# EAGLE design DNVT_box_front_2 (EAGLE 9.6.2)
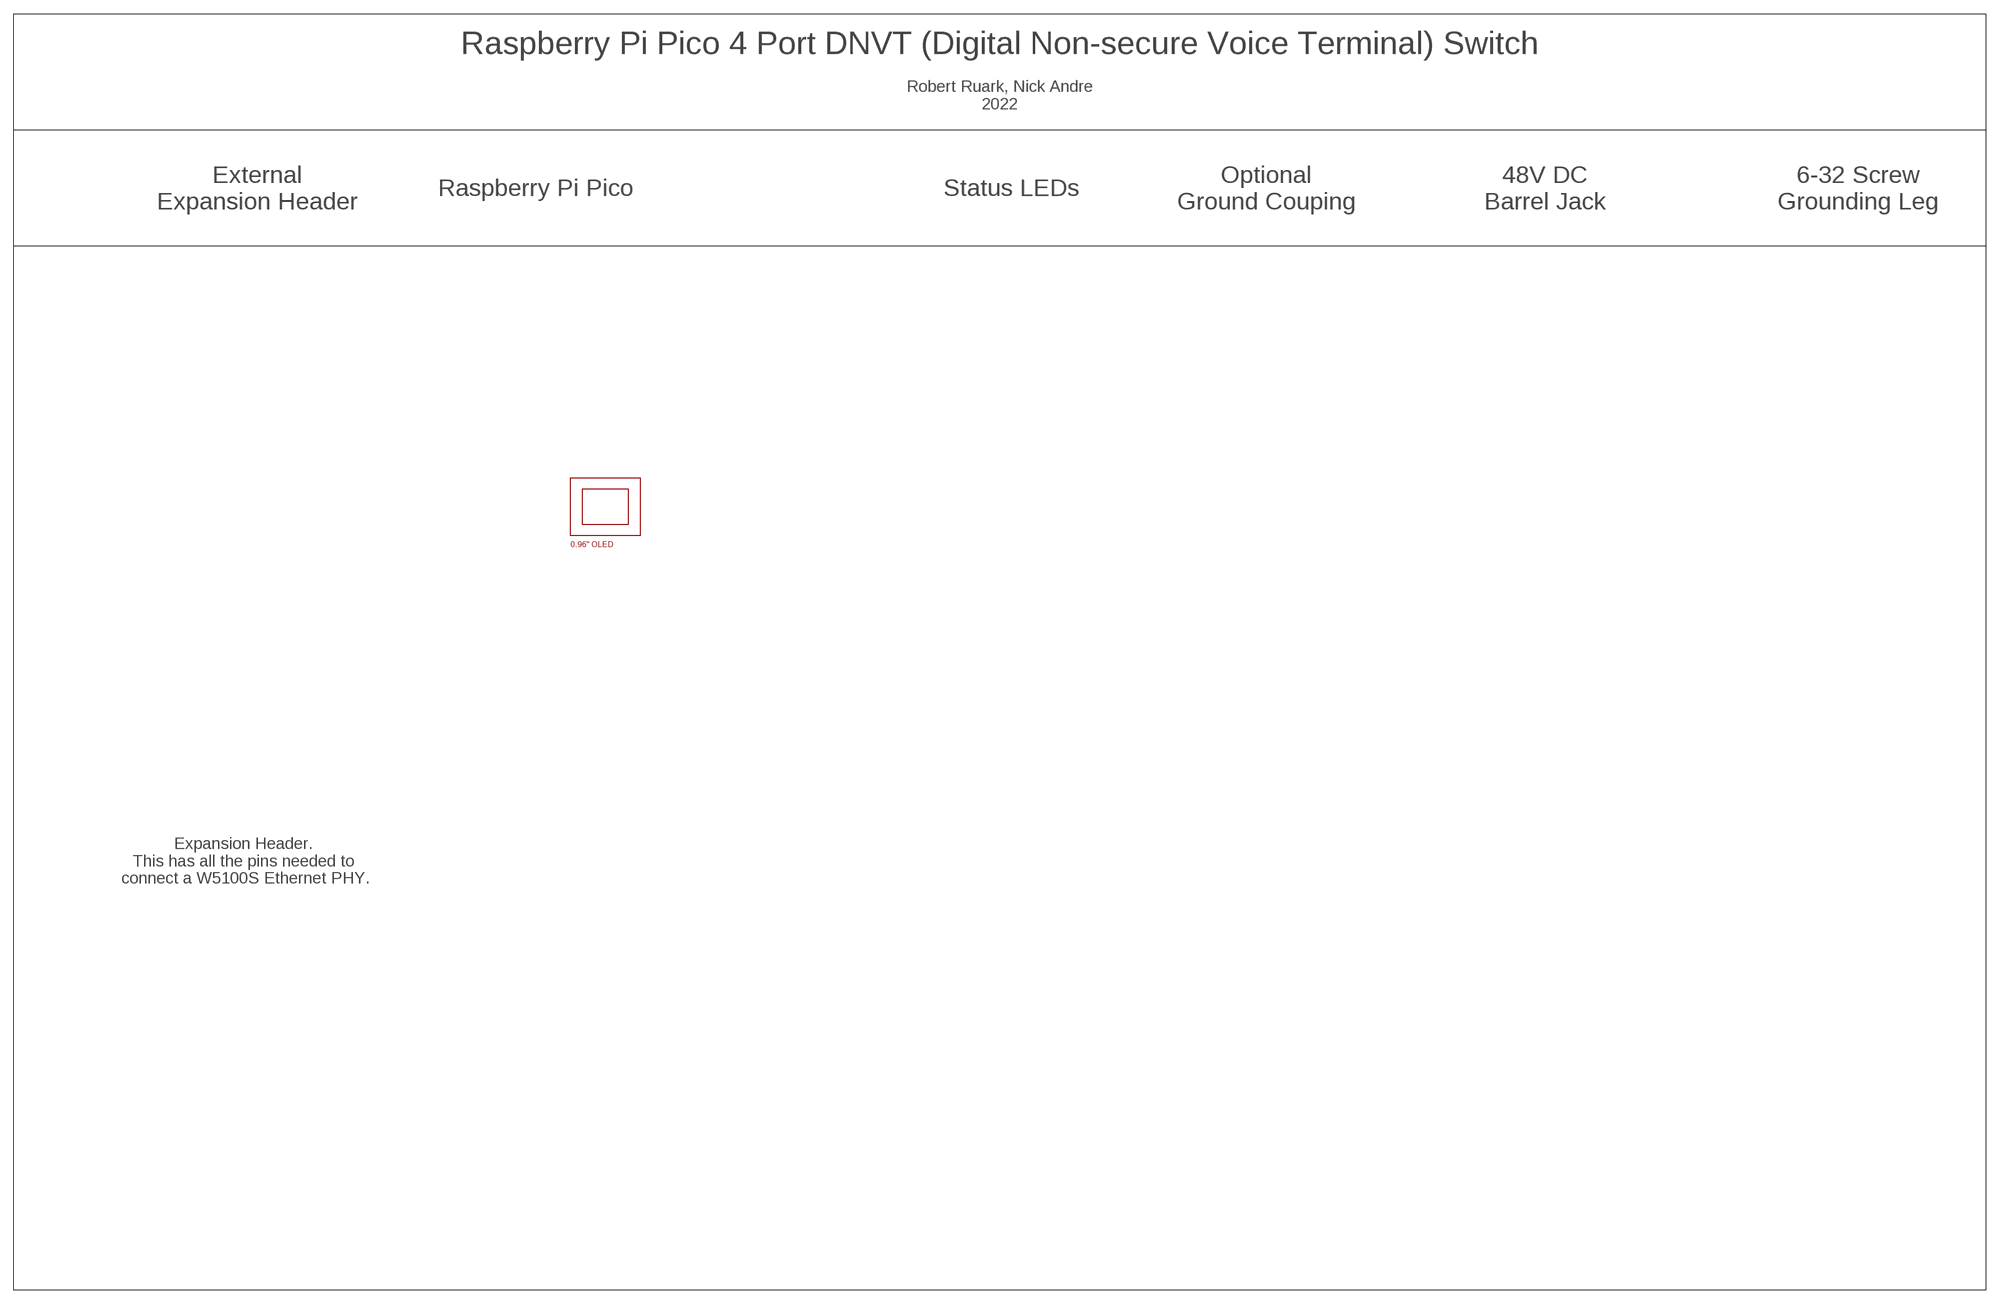
[diagram p0: schematic, sheet 1]

## Parts
U$1  OLED  [OLED]

## Notes on the sheet
- Raspberry Pi Pico 4 Port DNVT (Digital Non-secure Voice Terminal) Switch
- Robert Ruark, Nick Andre
  2022
- External
  Expansion Header
- Raspberry Pi Pico | Status LEDs
- Optional
  Ground Couping
- 48V DC
  Barrel Jack
- 6-32 Screw
  Grounding Leg
- Expansion Header. 
  This has all the pins needed to 
  connect a W5100S Ethernet PHY.

## Library data of the parts
U$1 = ruark2:OLED

## Net classes
1 HV: clearance 0.406 mm

## Board
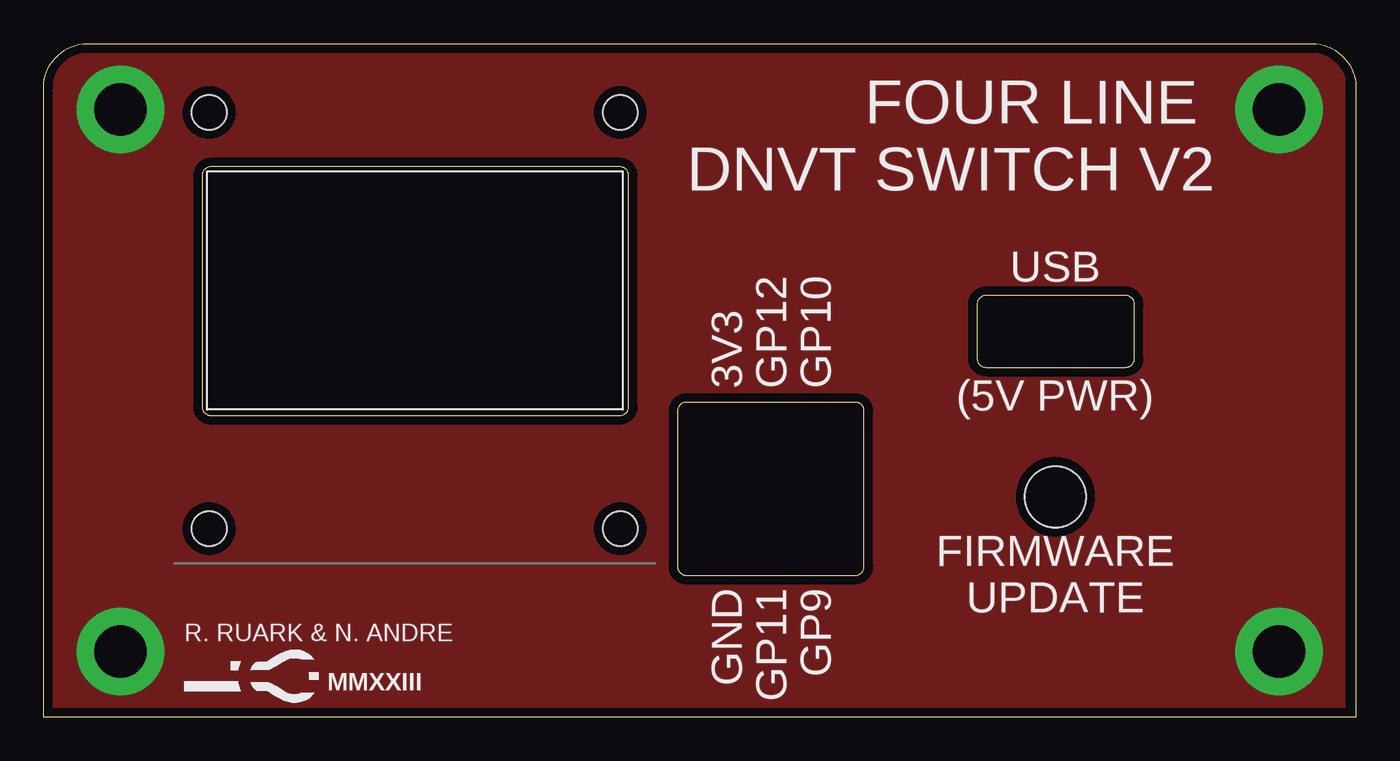
[diagram p1: board, top side]
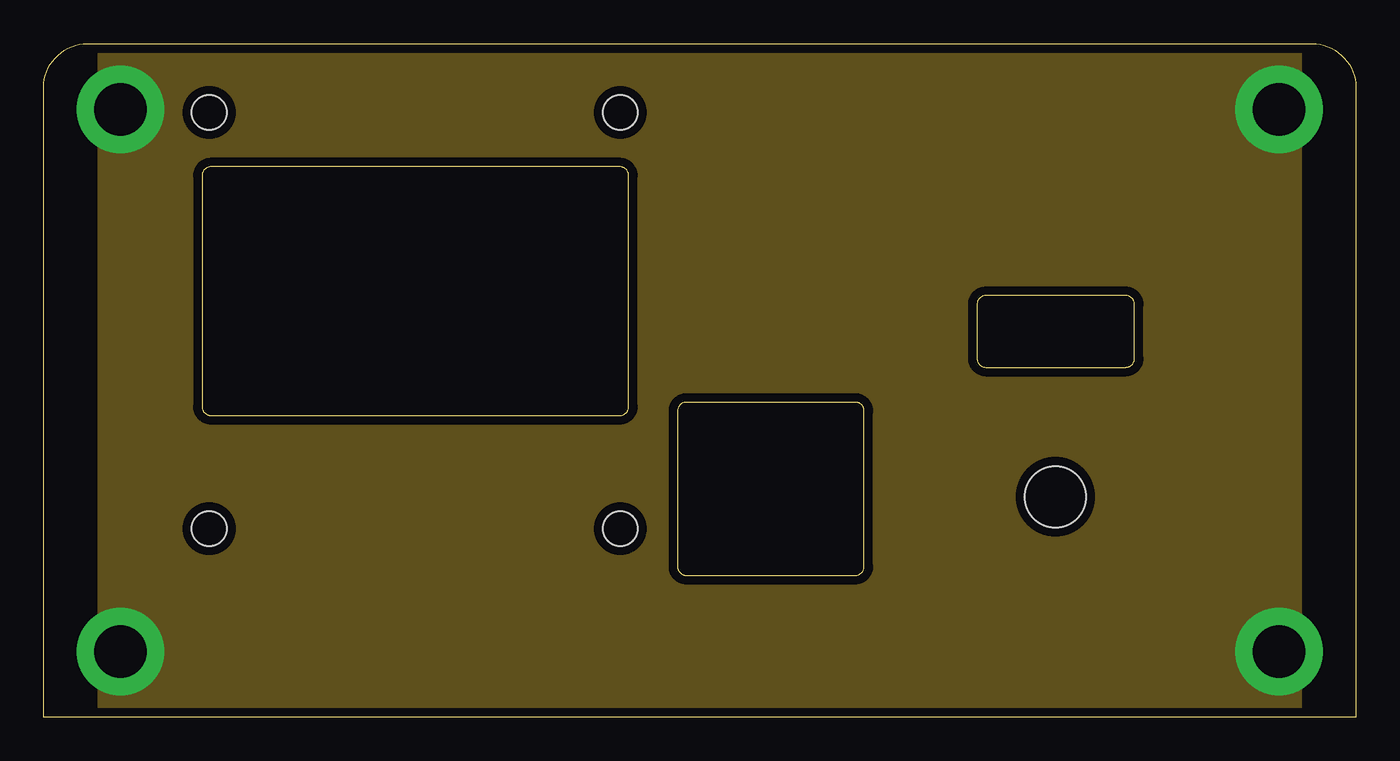
[diagram p2: board, inner layer Route2]
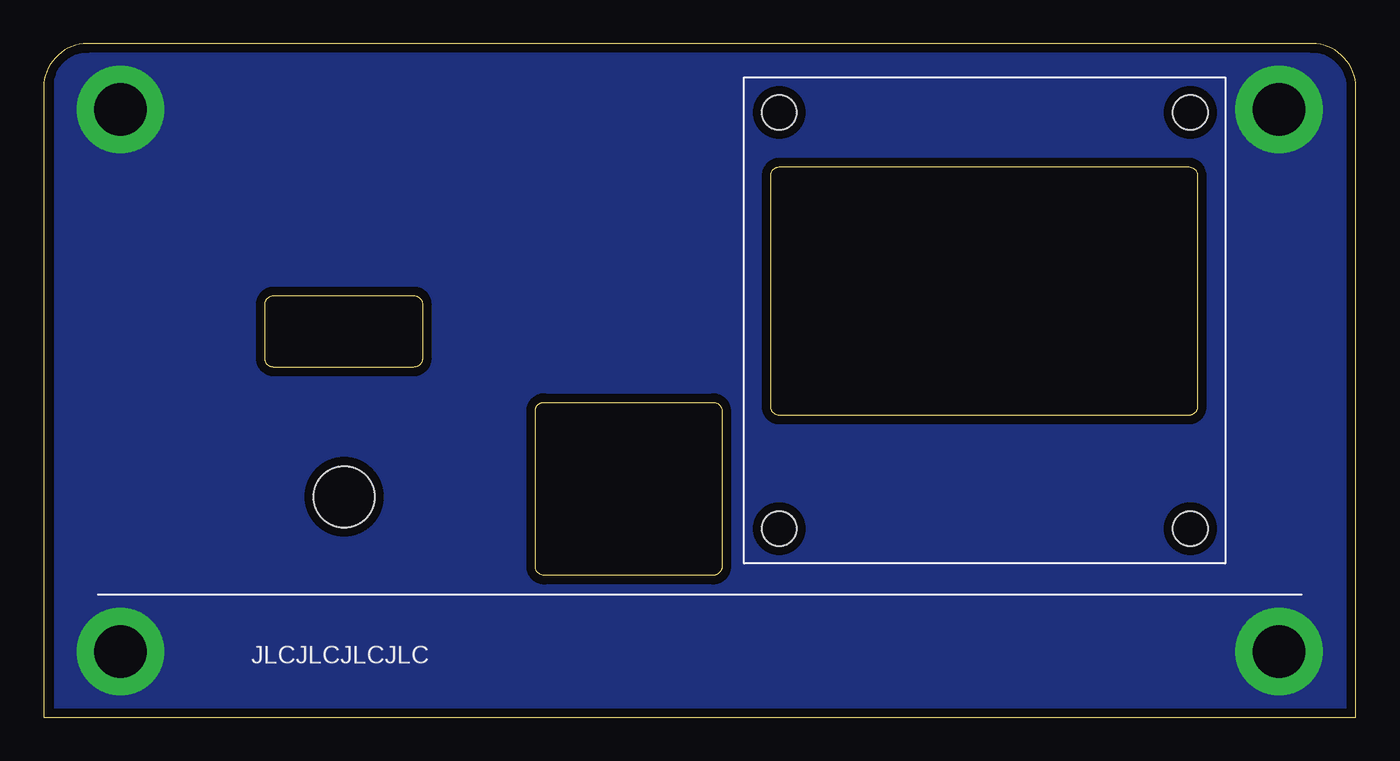
[diagram p3: board, bottom side, seen from below]

Size 75 x 38.5 mm. Coordinates in mm from the lower left corner, seen from the top.
Outline: 0,0 0,36 arc-90 2.5,38.5 72.5,38.5 arc-90 75,36 75,0 0,0
Outline: 36.23,17.5 36.23,8.6 arc90 36.73,8.1 46.4,8.1 arc90 46.9,8.6 46.9,17.5 arc90 46.4,18 36.73,18 arc90 36.23,17.5
Outline: 53.35,23.6 53.35,20.5 arc90 53.85,20 61.85,20 arc90 62.35,20.5 62.35,23.6 arc90 61.85,24.1 53.85,24.1 arc90 53.35,23.6
Outline: 9.05,30.96 9.05,17.74 arc90 9.55,17.24 32.94,17.24 arc90 33.44,17.74 33.44,30.96 arc90 32.94,31.46 9.55,31.46 arc90 9.05,30.96
Copper layers (1*16): Top 0.035mm / dielectric 1.5mm / Bottom 0.035mm
Design rules "default *": minimum track width 6mil, minimum drill 12mil, track to track 6mil, track to pad 6mil, pad to pad 6mil, via to via 6mil, smd to smd 6mil, copper to edge 20mil, drill to drill 6mil, minimum pad ring 0.13mm, minimum via ring 8mil, stop-mask expansion 4mil, vias tented up to drill 12mil, thermal gap 10mil
Holes 3.5 mm at 57.82,12.6

### Footprints (pad centres in the part's own frame; a part is rotated, then mirrored left to right if it is on the bottom)
OLED = hole 2: -25.5,-2; -2,-2; -25.5,-25.8; -2,-25.8

### Placement (x,y rotation side)
U$1  34.96,36.58 0 top

### Tracks (layer width: path | path; a pad name or v marks a point on that pad's centre or on a via)
GND  (via drill 3 pad 5)
  other vias: 4.4,3.75 4.4,34.76 70.6,3.75 70.6,34.76
  pour Route2: 3.21,54.36 71.79,54.1 71.79,-54.36 3.21,-54.1
  pour Top: 0.42,0.25 0.42,38.1 74.33,38.1 74.33,0.25
  pour Bottom: 0.42,0.25 0.42,38.1 74.33,38.1 74.33,0.25

### Text on the board
tPlace: FOUR LINE / DNVT SWITCH V2 | USB | 3V3 | GP12 | GP10 | (5V PWR) | FIRMWARE / UPDATE | GND | GP11 | GP9 | R. RUARK & N. ANDRE | MMXXIII
bPlace: JLCJLCJLCJLC
tStop: 012